# EAGLE design LMD18200 (EAGLE 7.2.0)
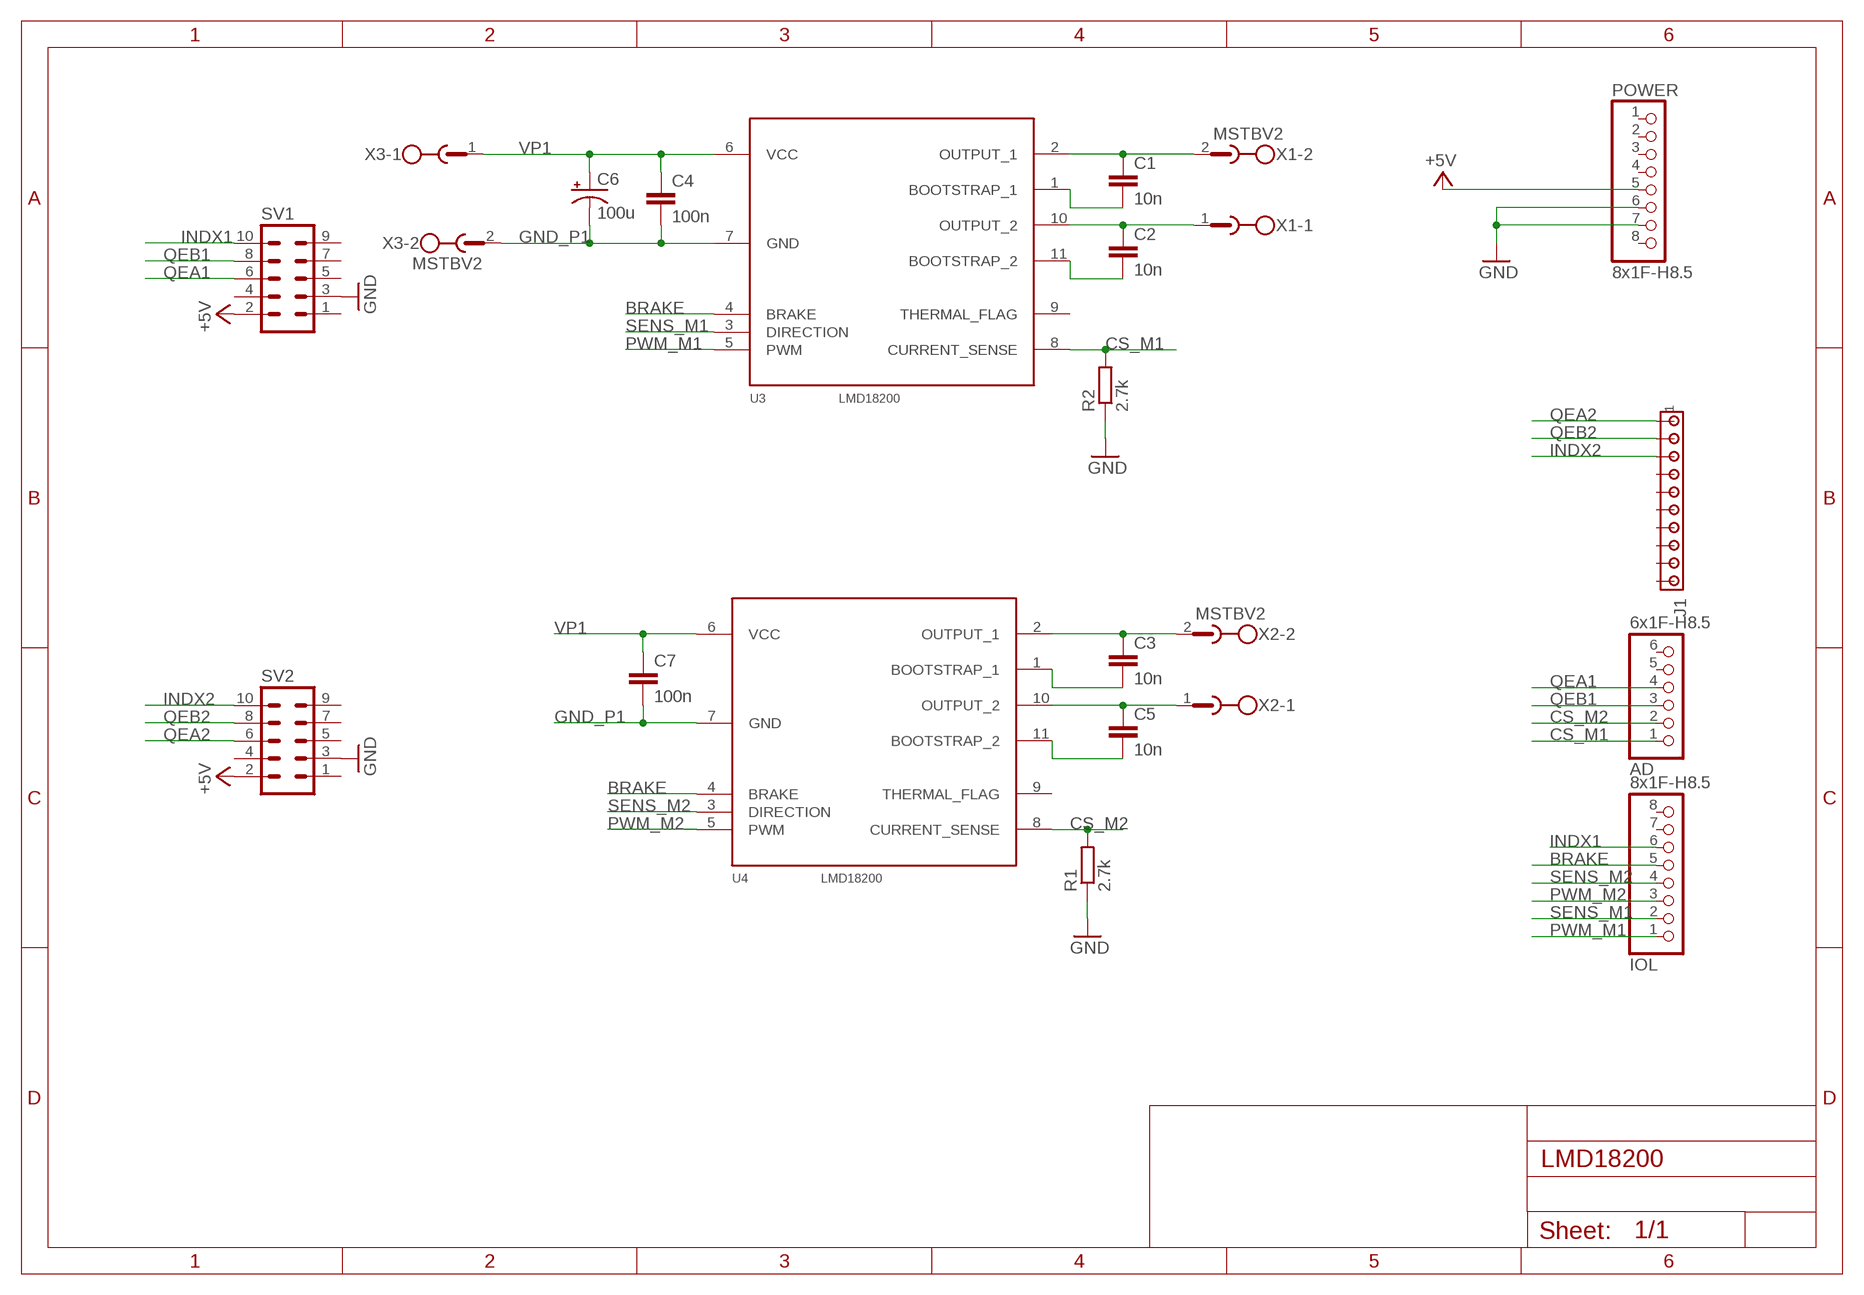
[diagram p0: schematic, sheet 1]

## Parts
AD  6x1F-H8.5  PINHD-1X6  [1X06]
C1  10n  C-EUC0603  [C0603]
C2  10n  C-EUC0603  [C0603]
C3  10n  C-EUC0603  [C0603]
C4  100n  C-EUC0603  [C0603]
C5  10n  C-EUC0603  [C0603]
C6  100u  CPOL-USE5-13  [E5-13]
C7  100n  C-EUC0603  [C0603]
IOL  8x1F-H8.5  PINHD-1X8  [1X08]
J1  MTA10-100  [10X10MTA]
POWER  8x1F-H8.5  PINHD-1X8  [1X08]
R1  2.7k  R-EU_R0805  [R0805]
R2  2.7k  R-EU_R0805  [R0805]
SV1  ML10L  [ML10L]
SV2  ML10L  [ML10L]
U3  LMD18200  [TO-220-11_C]
U4  LMD18200  [TO-220-11_C]
X1  MSTBV2  [MSTBV2]
X2  MSTBV2  [MSTBV2]
X3  MSTBV2  [MSTBV2]

## Nets
+5V [usbvcc]: POWER.5 SV1.2 SV2.2
BRAKE: IOL.5 U3.4(BRAKE) U4.4(BRAKE)
CS_M1: AD.1 R2.2 U3.8(CURRENT_SENSE)
CS_M2: AD.2 R1.2 U4.8(CURRENT_SENSE)
GND [gnd]: POWER.6 POWER.7 R1.1 R2.1 SV1.3 SV2.3
GND_P1: C4.2 C6.- C7.2 U3.7(GND) U4.7(GND) X3.2
INDX1: IOL.6 SV1.10
INDX2: J1.3 SV2.10
N$1: C2.2 U3.11(BOOTSTRAP_2)
N$2: C1.2 U3.1(BOOTSTRAP_1)
N$3: C1.1 U3.2(OUTPUT_1) X1.2
N$4: C2.1 U3.10(OUTPUT_2) X1.1
N$7: C3.1 U4.2(OUTPUT_1) X2.2
N$8: C5.1 U4.10(OUTPUT_2) X2.1
N$9: C3.2 U4.1(BOOTSTRAP_1)
N$10: C5.2 U4.11(BOOTSTRAP_2)
PWM_M1: IOL.1 U3.5(PWM)
PWM_M2: IOL.3 U4.5(PWM)
QEA1: AD.4 SV1.6
QEA2: J1.1 SV2.6
QEB1: AD.3 SV1.8
QEB2: J1.2 SV2.8
SENS_M1: IOL.2 U3.3(DIRECTION)
SENS_M2: IOL.4 U4.3(DIRECTION)
VP1: C4.1 C6.+ C7.1 U3.6(VCC) U4.6(VCC) X3.1
Unconnected: AD.5 AD.6 IOL.7 IOL.8 J1.4 J1.5 J1.6 J1.7 J1.8 J1.9 J1.10 POWER.1 POWER.2 POWER.3 POWER.4 POWER.8 SV1.1 SV1.4 SV1.5 SV1.7 SV1.9 SV2.1 SV2.4 SV2.5 SV2.7 SV2.9 U3.9(THERMAL_FLAG) U4.9(THERMAL_FLAG)

## Library data of the parts
AD = SmartPrj:PINHD-1X6: PIN HEADER; OC_FARNELL: 1593462
C1-C5 C7 = LibPerso:C-EU: CAPACITOR, European symbol
C6 = rcl:CPOL-US: POLARIZED CAPACITOR, American symbol
IOL POWER = SmartPrj:PINHD-1X8: PIN HEADER; OC_FARNELL: 1593463
J1 = LibPerso:MTA10-100: AMP connector
R1 R2 = LibPerso:R-EU_: RESISTOR, European symbol
SV1 SV2 = LibPerso:ML10L: HARTING; OC_FARNELL: unknown; OC_NEWARK: unknown
U3 U4 = LibPerso:LMD18200: National Semiconductor LMD18200 3A, 55V H-Bridge
X1-X3 = con-phoenix-508:MSTBV2: PHOENIX; MPN: MSTBV 2,5/2-GF-5.08; OC_FARNELL: 1792792; OC_NEWARK: 69R9845

## Net classes
0 default: width 0.254 mm, clearance 0.254 mm
1 power: width 0.61 mm, drill 0.61 mm, clearance 0.254 mm
2 gnd: width 0.305 mm, drill 0.559 mm, clearance 0.254 mm
3 usbvcc: width 0.508 mm, drill 0.61 mm, clearance 0.254 mm
4 aref: width 0.406 mm, drill 0.61 mm, clearance 0.254 mm

## Board
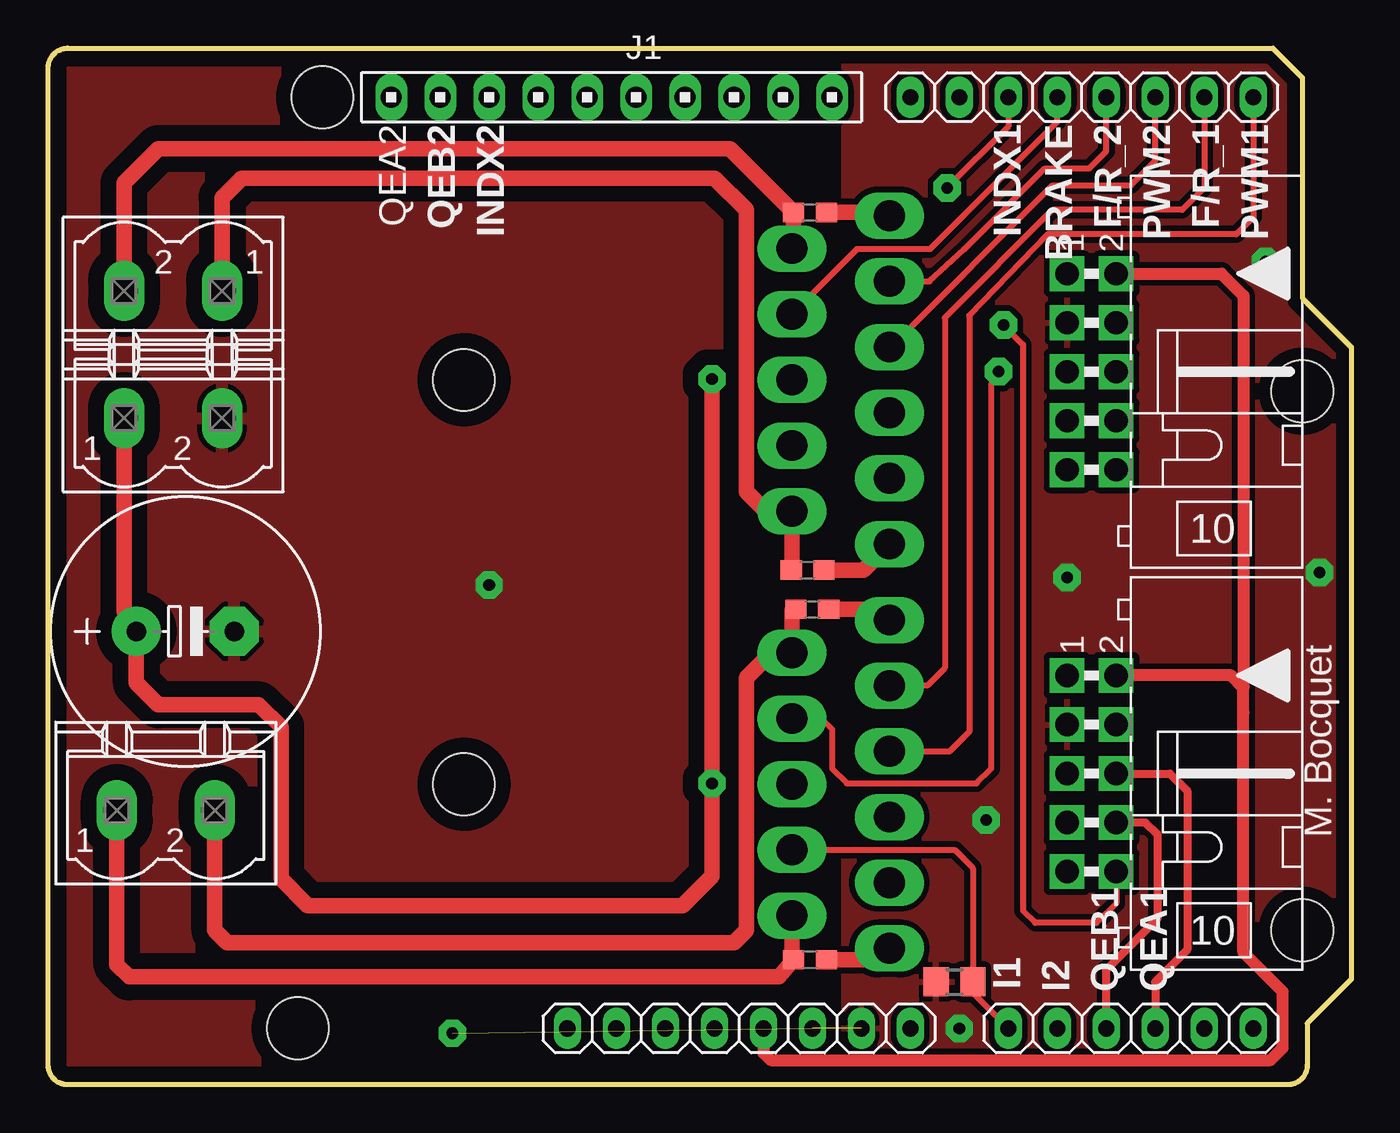
[diagram p1: board, top side]
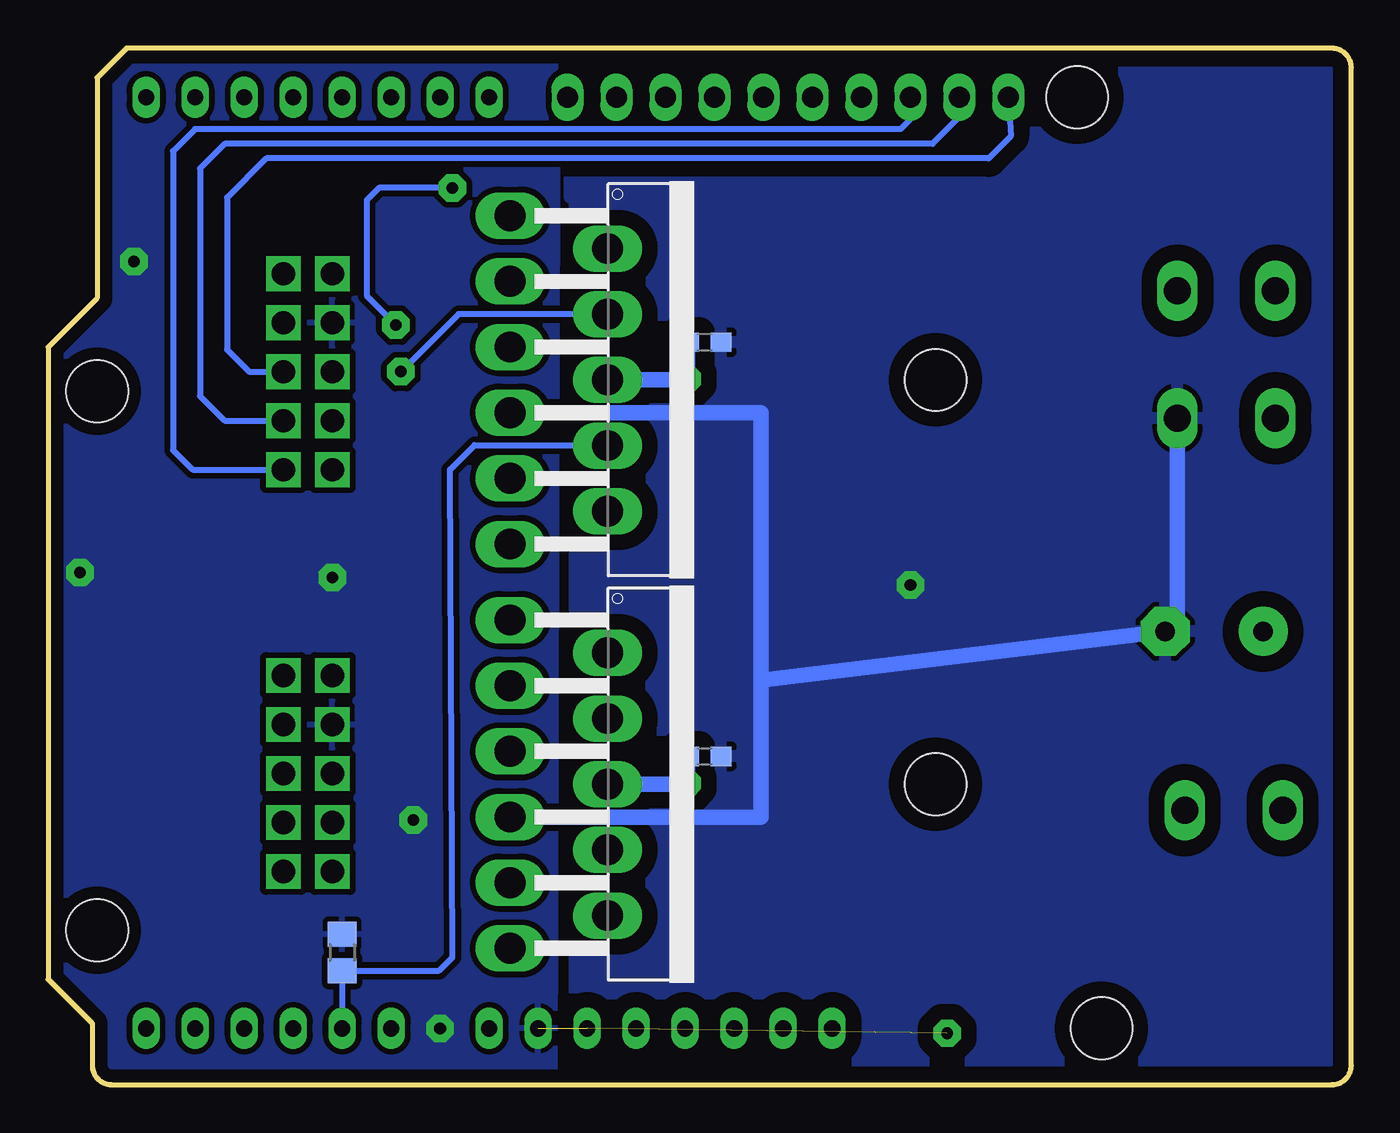
[diagram p2: board, bottom side, seen from below]

Size 67.56 x 53.72 mm. Coordinates in mm from the lower left corner, seen from the top.
Outline: 63.5,53.72 65.02,52.2 65.02,40.77 67.56,38.23 67.56,5.46 65.28,3.17 65.28,1 arc-90 64.28,0 1,0 arc-90 0,1 0,52.72 arc-90 1,53.72 63.5,53.72
Copper layers (1*16): Top 0.035mm / dielectric 1.5mm / Bottom 0.035mm
Design rules "default *": minimum track width 10mil, minimum drill 22mil, track to track 10mil, track to pad 10mil, pad to pad 10mil, via to via 12mil, smd to smd 8mil, copper to edge 26mil, drill to drill 12mil, minimum pad ring 10mil, minimum via ring 10mil, stop-mask expansion 1mil, vias tented up to drill 30mil, thermal gap 10mil
Holes 3.2 mm at 65.02,35.94 65.02,8 14.22,51.18 12.95,2.92

### Footprints (pad centres in the part's own frame; a part is rotated, then mirrored left to right if it is on the bottom)
1X06 = drill 0.85 pad 1.422 long: 1 -6.35,0; 2 -3.81,0; 3 -1.27,0; 4 1.27,0; 5 3.81,0; 6 6.35,0
C0603 = smd 1.1 x 1: 1 -0.85,0; 2 0.85,0
E5-13 = drill 1.016 pad 2.54: + -2.54,0 | drill 1.016 pad 2.54 octagon: - 2.54,0
1X08 = drill 0.85 pad 1.422 long: 1 -8.89,0; 2 -6.35,0; 3 -3.81,0; 4 -1.27,0; 5 1.27,0; 6 3.81,0; 7 6.35,0; 8 8.89,0
10X10MTA = drill 1.1 long: 1 11.43,0; 2 8.89,0; 3 6.35,0; 4 3.81,0; 5 1.27,0; 6 -1.27,0; 7 -3.81,0; 8 -6.35,0; 9 -8.89,0; 10 -11.43,0
R0805 = smd 1.3 x 1.5: 1 -0.95,0; 2 0.95,0
ML10L = drill 1.2 pad 1.778 square: 1 -5.08,-1.27; 2 -5.08,1.27; 3 -2.54,-1.27; 4 -2.54,1.27; 5 0,-1.27; 6 0,1.27; 7 2.54,-1.27; 8 2.54,1.27; 9 5.08,-1.27; 10 5.08,1.27
TO-220-11_C = drill 1.6 pad 1.93 long: 1 -8.084,-2.718; 2 -6.382,2.337; 3 -4.68,-2.718; 4 -2.978,2.337; 5 -1.276,-2.718; 6 0.425,2.337; 7 2.127,-2.718; 8 3.829,2.337; 9 5.531,-2.718; 10 7.233,2.337; 11 8.934,-2.718 | hole 3.2: 0.425,19.337
MSTBV2 = drill 1.397 long: 1 -2.54,0; 2 2.54,0

### Placement (x,y rotation side)
AD  56.13,2.92 0 top
C1  39.62,24.64 0 top
C2  39.5,6.48 0 top
C3  39.5,45.21 0 top
C4  33.53,17.02 0 bottom
C5  39.37,26.67 0 top
C6  7.11,23.5 0 top
C7  33.53,38.48 0 bottom
IOL  53.59,51.18 180 top
J1  29.21,51.18 180 top
POWER  35.81,2.92 0 top
R1  52.32,6.86 270 bottom
R2  46.99,5.33 0 top
SV1  54.1,16.13 270 top
SV2  54.1,36.96 270 top
U3  40.89,16 270 bottom
U4  40.89,36.96 270 bottom
X1  6.1,14.22 0 top
X2  6.48,41.15 180 top
X3  6.48,34.54 0 top

### Tracks (layer width: path | path; a pad name or v marks a point on that pad's centre or on a via)
+5V
  Top 0.61: POWER.5 37.08,1.65 37.47,1.27 63.37,1.27 64.01,1.91 64.01,4.83 61.98,6.86 61.98,19.3 61.98,20.57 | 61.98,20.57 61.34,21.21 SV1.2 | SV2.2 60.83,42.04 61.98,40.89 61.98,20.57
BRAKE  (via drill 0.6 pad 1.42)
  Top 0.305: U3.4 40.08,18.98 40.64,18.41 40.64,16.38 41.4,15.62 48.13,15.62 48.9,16.38 48.9,36.32 v49.28,36.96 | U4.4 41.93,43.31 45.72,43.31 52.32,49.91 IOL.5
  Bottom 0.305: U4.4 46.3,39.94 v49.28,36.96
CS_M1
  Top 0.305: U3.8 47.01,12.17 47.94,11.24 R2.2 47.94,4.77 AD.1
CS_M2
  Bottom 0.305: AD.2 R1.2 47.3,5.91 46.61,6.6 46.74,31.88 45.47,33.15 38.58,33.15 U4.8
GND  (via drill 0.6 pad 1.42)  (2 unrouted)
  other vias: 48.64,13.72 52.83,26.29 65.91,26.54 20.95,2.67 47.24,2.92 63.12,42.67
  pour Bottom (isolate 0.305): 41.27,53.72 67.94,53.72 67.94,0.13 41.27,0 41.15,47.12
  pour Top (isolate 0.305): 41.27,53.72 68.07,53.72 68.07,0.13 41.27,0
GND_P1  (via drill 0.6 pad 1.42)
  Bottom 0.813: U3.7 30.61,13.88 30.61,20.96 | 30.61,20.96 C6.- 9.02,24.13 X3.2 | U4.7 30.61,34.83 30.61,20.96
  other vias: 22.86,25.91
  pour Top (isolate 0.813): 0.25,0.13 40.26,0 40.26,53.72 0.25,53.59
  pour Bottom (isolate 0.813): 0.25,0.13 40.26,0 40.26,45.97 40.51,45.97 40.51,53.59 0.25,53.59
INDX1  (via drill 0.6 pad 1.42)
  Top 0.305: SV1.10 55.37,9.4 54.36,8.38 51.18,8.38 50.55,9.02 50.55,38.35 v49.53,39.37 | IOL.6 49.78,49.66 v46.61,46.48
  Bottom 0.305: v46.61,46.48 50.42,46.48 51.05,45.85 51.05,40.89 v49.53,39.37
INDX2
  Bottom 0.305: J1.3 22.86,50.04 23.37,49.53 59.94,49.53 61.09,48.39 61.09,32.89 60.07,31.88 SV2.10
N$1
  Top 0.813: C2.2 42.89,6.48 U3.11
N$2
  Top 0.813: C1.2 42.93,24.64 U3.1
N$3
  Top 0.813: X1.2 8.64,8 9.27,7.37 35.56,7.37 36.2,8 36.2,21.08 37.5,22.38 U3.2 38.56,24.6 C1.1
N$4
  Top 0.813: U3.10 38.56,6.51 C2.1 37.88,5.59 4.19,5.59 3.56,6.22 X1.1
N$7
  Top 0.813: X2.2 3.94,46.74 5.71,48.51 35.34,48.51 C3.1 38.65,43.43 U4.2
N$8
  Top 0.813: X2.1 9.02,45.97 10.03,46.99 34.54,46.99 36.2,45.34 36.2,30.73 37.21,29.72 U4.10 38.56,26.71 C5.1
N$9
  Top 0.813: C3.2 43.61,45.21 U4.1
N$10
  Top 0.813: C5.2 42.26,26.67 U4.11
PWM_M1
  Top 0.305: IOL.1 62.48,44.96 61.6,44.07 51.82,44.07 47.75,39.88 47.75,18.29 46.74,17.28 U3.5
PWM_M2
  Top 0.305: IOL.3 57.4,47.88 56.13,46.61 52.07,46.61 43.69,38.23 U4.5
QEA1
  Top 0.406: SV1.6 58.17,16.13 59.05,15.24 59.05,6.99 57.4,5.33 AD.4
QEA2
  Bottom 0.305: J1.1 17.65,49.15 18.8,48.01 56.26,48.01 58.29,45.97 58.29,38.1 57.15,36.96 SV2.6
QEB1
  Top 0.406: AD.3 54.86,5.97 57.53,8.64 57.53,12.95 56.9,13.59 SV1.8
QEB2
  Bottom 0.305: J1.2 20.32,50.16 21.72,48.77 58.42,48.77 59.69,47.5 59.69,35.69 58.42,34.42 SV2.8
SENS_M1
  Top 0.305: IOL.2 59.94,46.48 58.8,45.34 52.07,45.34 46.48,39.75 46.48,21.59 45.57,20.68 U3.3
SENS_M2
  Top 0.305: IOL.4 54.86,48.39 53.98,47.5 51.69,47.5 47.5,43.31 45.7,41.64 U4.3
VP1  (via drill 0.6 pad 1.42)
  Top 0.813: v34.42,36.58 v34.42,15.62 34.42,10.79 32.89,9.27 13.46,9.27 12.07,10.67 12.07,18.54 10.92,19.68 5.71,19.68 4.57,20.83 C6.+ 4.19,24.26 3.94,24.51 X3.1
  Bottom 0.813: U3.6 34.42,15.58 v34.42,15.62 34.42,16.98 C4.1 | U4.6 34.5,36.53 v34.42,36.58 34.42,38.44 C7.1

### Text on the board
tNames: QEA2 | QEB2 | INDX2 | INDX1 | BRAKE | F/R_2 | PWM2 | F/R_1 | PWM1 | M. Bocquet | I1 | I2 | QEB1 | QEA1
214bmp: D:/SmartProjects/Snc/a4_bn_logo2.bmp